# Altium schematic sheet Fusebox.SchDoc: Fusebox
size A4; CheckedBy: Nico Bieberich; Author: Nico Bieberich; Organization: Baltic Racing; Address1: Zur Schwedenschanze 15; Address2: Haus 18; Address3: 18435 Stralsund; Revision: xx.xx; SheetNumber: 1; SheetTotal: 6; Rules: LVS; ProjectName: Projekt
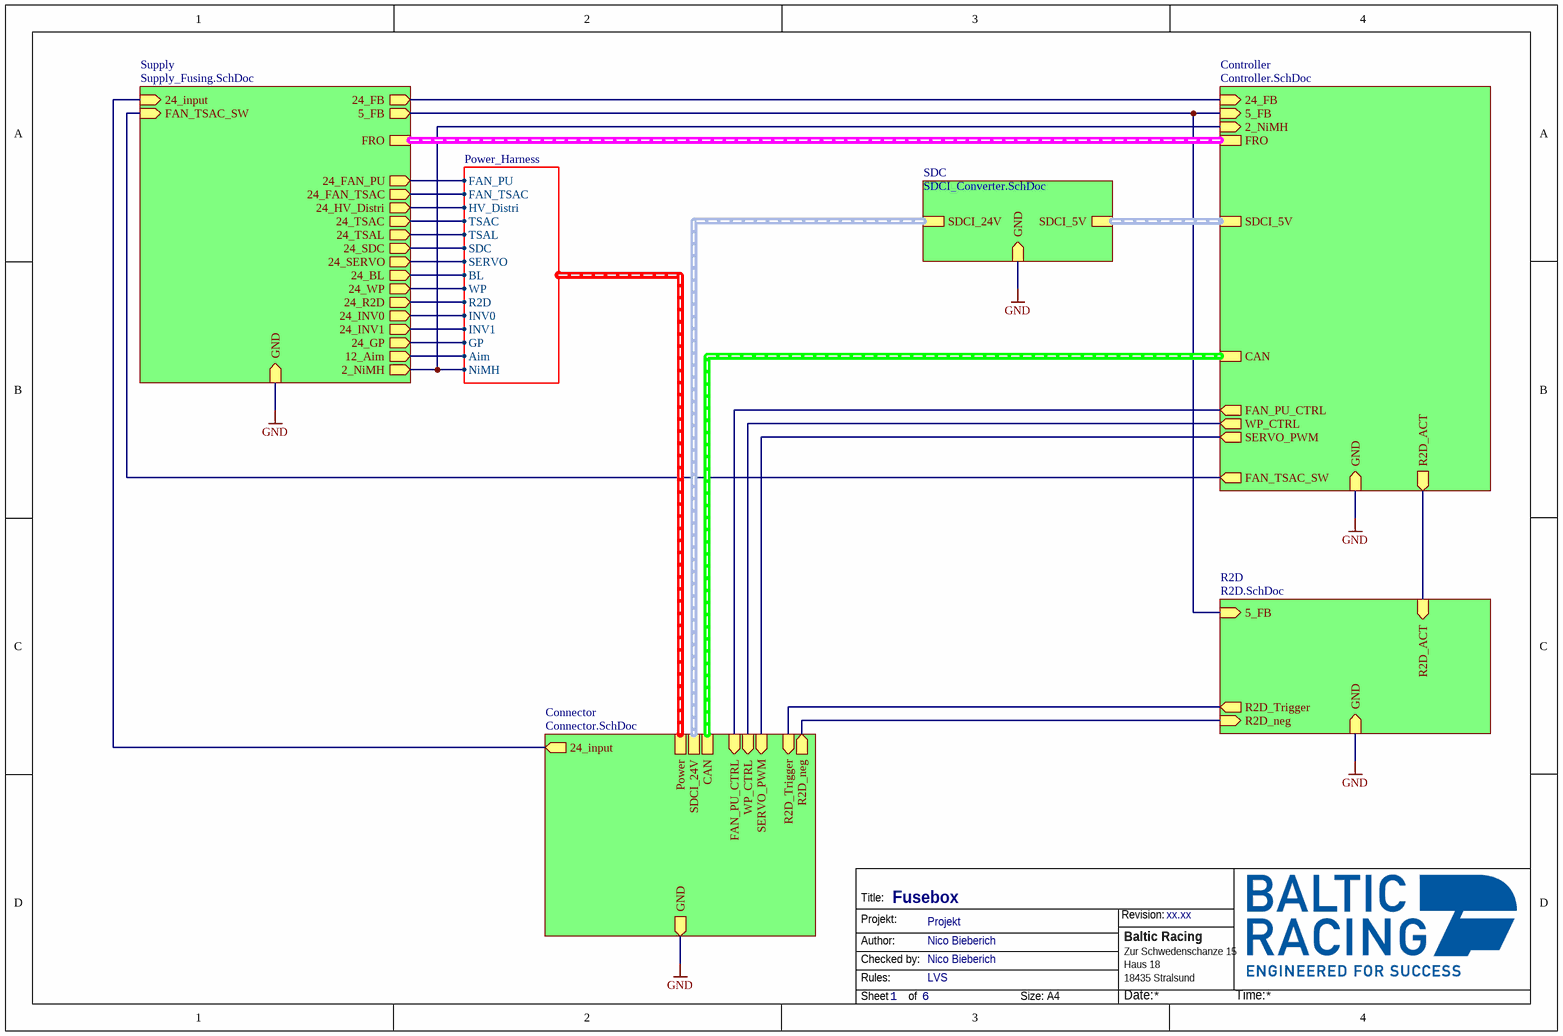
[diagram p0: Fusebox.SchDoc]

## Sub-sheets
Connector = Connector.SchDoc: Power (harness Power_Harness), GND (out), SDCI_24V (harness SDCI_24V_Harness), 24_input (out), CAN (harness CAN_Harness), FAN_PU_CTRL (in), WP_CTRL (in), R2D_Trigger (in), SERVO_PWM (in), R2D_neg (out)
Controller = Controller.SchDoc: SDCI_5V (harness SDCI_5V_Harness), FRO (harness FRO_Harness), 5_FB (in), GND (in), CAN (harness CAN_Harness), 24_FB (in), 2_NiMH (in), FAN_TSAC_SW (out), FAN_PU_CTRL (out), WP_CTRL (out), R2D_ACT (out), SERVO_PWM (out)
R2D = R2D.SchDoc: R2D_ACT (in), GND (in), 5_FB (in), R2D_Trigger (out), R2D_neg (in)
SDC = SDCI_Converter.SchDoc: SDCI_5V (harness SDCI_5V_Harness), SDCI_24V (harness SDCI_24V_Harness), GND (in)
Supply = Supply_Fusing.SchDoc: 24_input (in), FAN_TSAC_SW (in), GND (in), 24_GP (out), 24_HV_Distri (out), 24_BL (out), 24_SDC (out), 24_FAN_TSAC (out), 24_FAN_PU (out), 24_WP (out), 24_TSAL (out), 24_TSAC (out), 24_INV0 (out), 24_INV1 (out), 24_FB (out), 12_Aim (out), 5_FB (out), 2_NiMH (out), FRO (harness FRO_Harness), 24_SERVO (out), 24_R2D (out)

## Harnesses
Power_Harness: GP, HV_Distri, BL, SDC, FAN_TSAC, FAN_PU, WP, TSAL, TSAC, INV0, INV1, Aim, NiMH, SERVO, R2D

## Nets
GND: sheet Supply/GND, sheet Connector/GND, sheet Controller/GND, sheet R2D/GND, sheet SDC/GND
(unnamed): sheet Supply/24_input, sheet Connector/24_input
(unnamed): sheet Supply/FAN_TSAC_SW, sheet Controller/FAN_TSAC_SW
(unnamed): sheet Supply/24_GP, sheet Connector/Power.GP
(unnamed): sheet Supply/24_HV_Distri, sheet Connector/Power.HV_Distri
(unnamed): sheet Supply/24_BL, sheet Connector/Power.BL
(unnamed): sheet Supply/24_SDC, sheet Connector/Power.SDC
(unnamed): sheet Supply/24_FAN_TSAC, sheet Connector/Power.FAN_TSAC
(unnamed): sheet Supply/24_FAN_PU, sheet Connector/Power.FAN_PU
(unnamed): sheet Supply/24_WP, sheet Connector/Power.WP
(unnamed): sheet Supply/24_TSAL, sheet Connector/Power.TSAL
(unnamed): sheet Supply/24_TSAC, sheet Connector/Power.TSAC
(unnamed): sheet Supply/24_INV0, sheet Connector/Power.INV0
(unnamed): sheet Supply/24_INV1, sheet Connector/Power.INV1
(unnamed): sheet Supply/24_FB, sheet Controller/24_FB
(unnamed): sheet Supply/12_Aim, sheet Connector/Power.Aim
(unnamed): sheet Supply/5_FB, sheet Controller/5_FB, sheet R2D/5_FB
(unnamed): sheet Supply/2_NiMH, sheet Controller/2_NiMH, sheet Connector/Power.NiMH
(unnamed): sheet Supply/24_SERVO, sheet Connector/Power.SERVO
(unnamed): sheet Supply/24_R2D, sheet Connector/Power.R2D
(unnamed): sheet Connector/FAN_PU_CTRL, sheet Controller/FAN_PU_CTRL
(unnamed): sheet Connector/WP_CTRL, sheet Controller/WP_CTRL
(unnamed): sheet Connector/R2D_Trigger, sheet R2D/R2D_Trigger
(unnamed): sheet Connector/SERVO_PWM, sheet Controller/SERVO_PWM
(unnamed): sheet Connector/R2D_neg, sheet R2D/R2D_neg
(unnamed): sheet Controller/R2D_ACT, sheet R2D/R2D_ACT

## Buses and harness runs
harness sheet Connector/CAN = sheet Controller/CAN
harness sheet Connector/SDCI_24V = sheet SDC/SDCI_24V
harness sheet Controller/FRO = sheet Supply/FRO
harness sheet Controller/SDCI_5V = sheet SDC/SDCI_5V

## Notes on the sheet
- Title:
- Projekt:
- Revision:
- Author:
- Rules:
- Checked by:
- Sheet
- of
- Size:
- A4
- Date:
- Time: